# EAGLE design MCP23S17 Breakout (EAGLE 7.6.0)
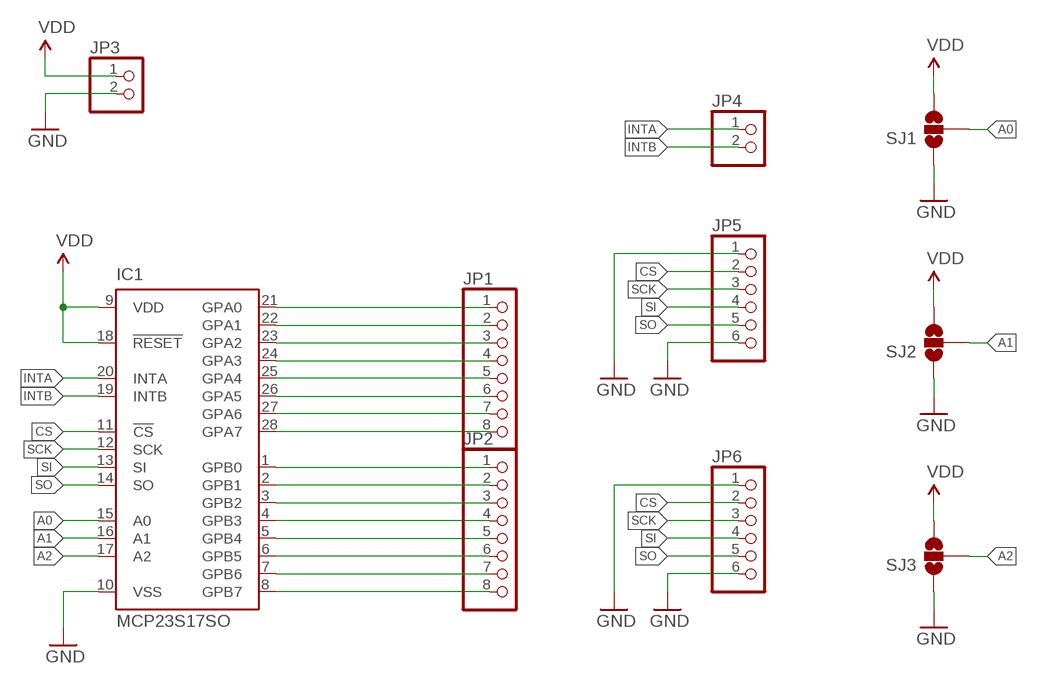
[diagram p0: schematic, sheet 1]

## Parts
IC1  MCP23S17SO  [SO28W]
JP1  PINHD-1X8  [1X08]
JP2  PINHD-1X8  [1X08]
JP3  PINHD-1X2  [1X02]
JP4  PINHD-1X2  [1X02]
JP5  PINHD-1X6  [1X06]
JP6  PINHD-1X6  [1X06]
SJ1  SOLDERJUMPER_2WAYT  [SJ_2]
SJ2  SOLDERJUMPER_2WAYT  [SJ_2]
SJ3  SOLDERJUMPER_2WAYT  [SJ_2]

## Nets
3.3V: IC1.9(VDD) IC1.18(!RESET) JP3.1 SJ1.3 SJ2.3 SJ3.3 ; supply symbol labelled VDD
A0: IC1.15(A0) SJ1.2
A1: IC1.16(A1) SJ2.2
A2: IC1.17(A2) SJ3.2
CS: IC1.11(!CS) JP5.2 JP6.2
GND: IC1.10(VSS) JP3.2 JP5.1 JP5.6 JP6.1 JP6.6 SJ1.1 SJ2.1 SJ3.1
INTA: IC1.20(INTA) JP4.1
INTB: IC1.19(INTB) JP4.2
N$1: IC1.21(GPA0) JP1.1
N$2: IC1.22(GPA1) JP1.2
N$3: IC1.23(GPA2) JP1.3
N$4: IC1.24(GPA3) JP1.4
N$5: IC1.25(GPA4) JP1.5
N$6: IC1.26(GPA5) JP1.6
N$7: IC1.27(GPA6) JP1.7
N$8: IC1.28(GPA7) JP1.8
N$9: IC1.1(GPB0) JP2.1
N$10: IC1.2(GPB1) JP2.2
N$11: IC1.3(GPB2) JP2.3
N$12: IC1.4(GPB3) JP2.4
N$13: IC1.5(GPB4) JP2.5
N$14: IC1.6(GPB5) JP2.6
N$15: IC1.7(GPB6) JP2.7
N$16: IC1.8(GPB7) JP2.8
SCK: IC1.12(SCK) JP5.3 JP6.3
SI: IC1.13(SI) JP5.4 JP6.4
SO: IC1.14(SO) JP5.5 JP6.5

## Library data of the parts
IC1 = microchip:MCP23S17: http://ww1.microchip.com/downloads/en/DeviceDoc/21952a.pdf Source: http://ww1.microchip.com/downloads/en/DeviceDoc/21952a.pdf; MF: MICROCHIP; MPN: MCP23S17-E/SO; OC_FARNELL: unknown; OC_NEWARK: 31K2950
JP1 JP2 = pinhead:PINHD-1X8: PIN HEADER
JP3 JP4 = pinhead:PINHD-1X2: PIN HEADER
JP5 JP6 = pinhead:PINHD-1X6: PIN HEADER
SJ1-SJ3 = SparkFun-Retired:SOLDERJUMPER_2WAY: Solder Jumper 2 way solder jumper

## Board
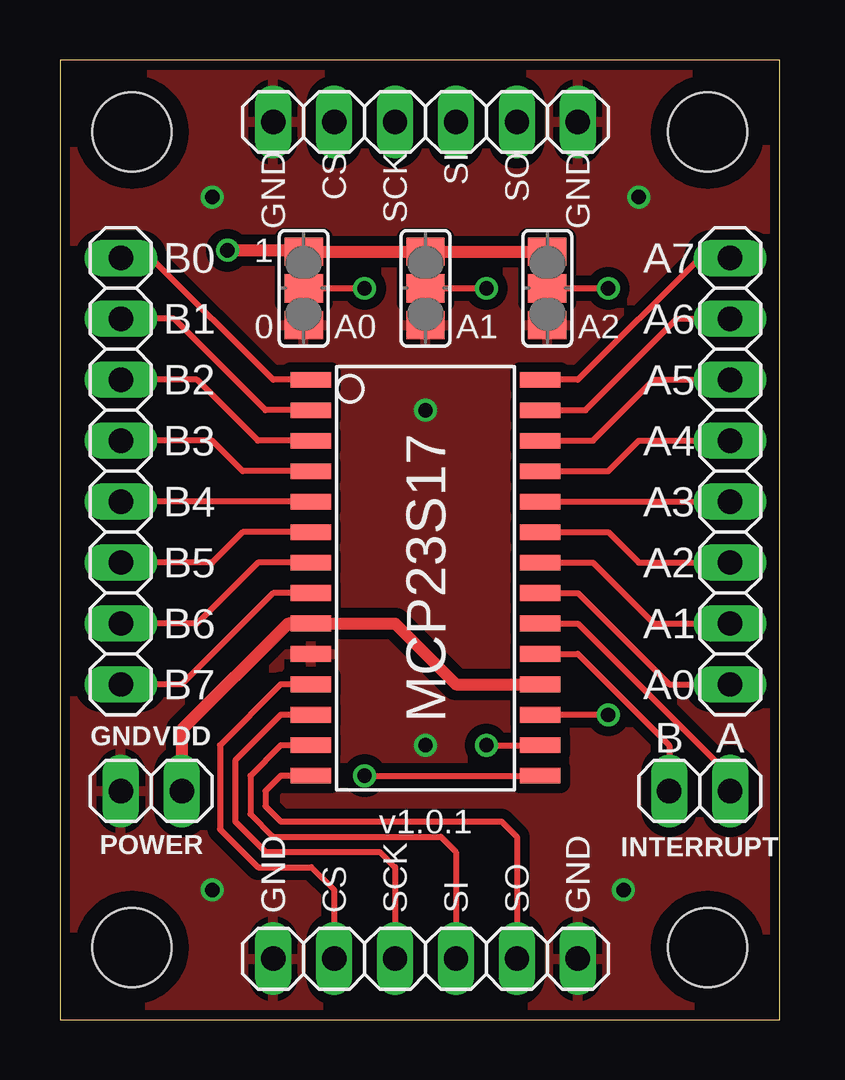
[diagram p1: board, top side]
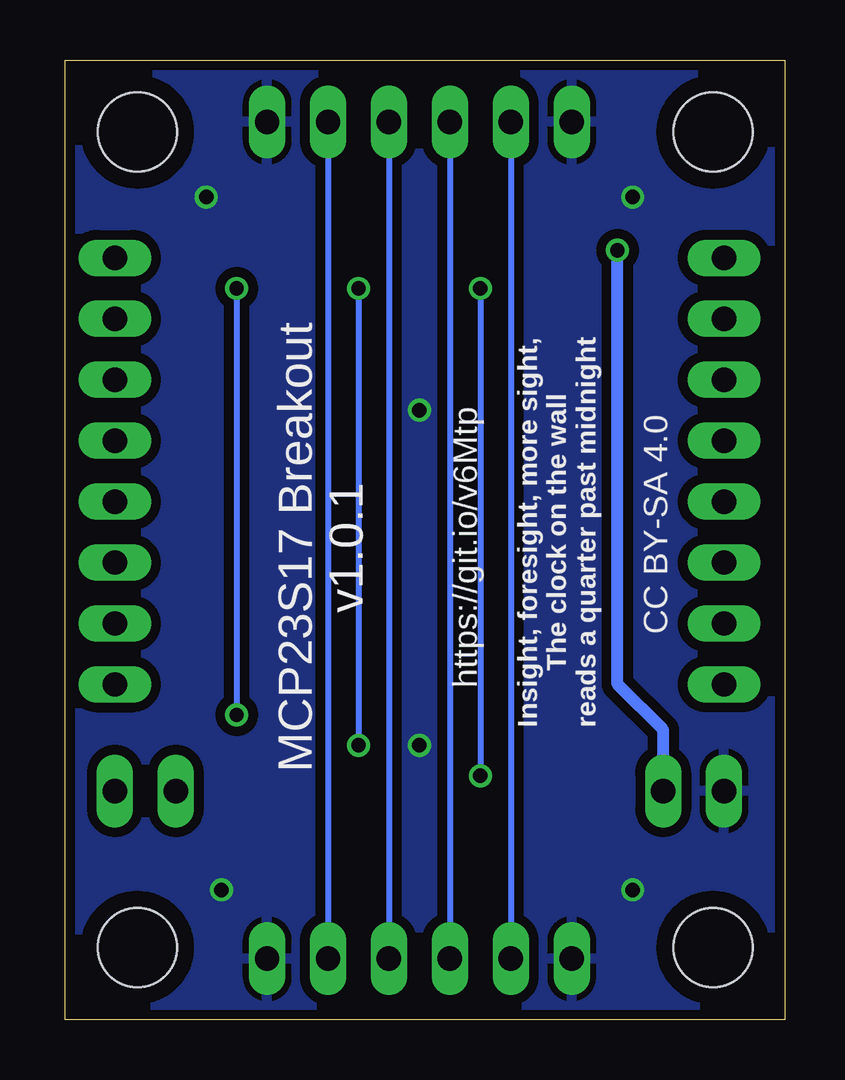
[diagram p2: board, bottom side, seen from below]

Size 30 x 40 mm. Coordinates in mm from the lower left corner, seen from the top.
Outline: 0,0 30,0 30,40 0,40 0,0
Copper layers (1*16): Top 0.0356mm / dielectric 1.5011mm / Bottom 0.0356mm
Design rules "LaenPCBOrder": minimum track width 6mil, minimum drill 13mil, track to track 6mil, track to pad 6mil, pad to pad 6mil, via to via 6mil, smd to smd 6mil, copper to edge 15mil, drill to drill 6mil, minimum pad ring 7mil, minimum via ring 7mil, stop-mask expansion 3mil, vias tented up to drill 0mil, thermal gap 10mil

### Footprints (pad centres in the part's own frame; a part is rotated, then mirrored left to right if it is on the bottom)
SO28W = smd 0.65 x 1.7: 1 -7.62,-4.78; 2 -6.35,-4.78; 3 -5.08,-4.78; 4 -3.81,-4.78; 5 -2.54,-4.78; 6 -1.27,-4.78; 7 0,-4.78; 8 1.27,-4.78; 9 2.54,-4.78; 10 3.81,-4.78; 11 5.08,-4.78; 12 6.35,-4.78; 13 7.62,-4.78; 14 8.89,-4.78; 15 8.89,4.78; 16 7.62,4.78; 17 6.35,4.78; 18 5.08,4.78; 19 3.81,4.78; 20 2.54,4.78; 21 1.27,4.78; 22 0,4.78; 23 -1.27,4.78; 24 -2.54,4.78; 25 -3.81,4.78; 26 -5.08,4.78; 27 -6.35,4.78; 28 -7.62,4.78
1X08 = drill 1.016 long: 1 -8.89,0; 2 -6.35,0; 3 -3.81,0; 4 -1.27,0; 5 1.27,0; 6 3.81,0; 7 6.35,0; 8 8.89,0
1X02 = drill 1.016 long: 1 -1.27,0; 2 1.27,0
1X06 = drill 1.016 long: 1 -6.35,0; 2 -3.81,0; 3 -1.27,0; 4 1.27,0; 5 3.81,0; 6 6.35,0
SJ_2 = smd 1.168 x 1.6: 1 -1.524,0; 2 0,0; 3 1.524,0
STAND-OFF = hole 3.302: 0,0

### Placement (x,y rotation side)
IC1  15.24,19.05 270 top
JP1  27.94,22.86 90 top
JP2  2.54,22.86 270 top
JP3  3.81,9.53 180 top
JP4  26.67,9.53 180 top
JP5  15.24,2.54 0 top
JP6  15.24,37.42 0 top
SJ1  10.16,30.48 90 top
SJ2  15.24,30.48 90 top
SJ3  20.32,30.48 90 top
U$1  [STAND-OFF]  3,37 90 top
U$2  [STAND-OFF]  27,37 0 top
U$3  [STAND-OFF]  3,3 0 top
U$4  [STAND-OFF]  27,3 0 top

### Tracks (layer width: path | path; a pad name or v marks a point on that pad's centre or on a via)
3.3V  (via drill 0.6)
  Top 0.508: IC1.18 16.51,13.97 13.97,16.51 IC1.9 9.53,16.51 5.08,12.06 JP3.1 | v6.99,32.07 10.1,32.07 SJ1.3 SJ2.3 SJ3.3
  Bottom 0.508: JP3.1 5.08,12.06 6.99,13.97 v6.99,32.07
A0  (via drill 0.6)
  Top 0.254: v12.7,10.16 IC1.15 | SJ1.2 v12.7,30.48
  Bottom 0.254: v12.7,30.48 v12.7,10.16
A1  (via drill 0.6)
  Top 0.254: v17.78,11.43 IC1.16 | SJ2.2 v17.78,30.48
  Bottom 0.254: v17.78,30.48 v17.78,11.43
A2  (via drill 0.6)
  Top 0.254: v22.86,12.7 IC1.17 | SJ3.2 v22.86,30.48
  Bottom 0.254: v22.86,30.48 v22.86,12.7
CS
  Top 0.254: IC1.11 9.21,13.97 6.67,11.43 6.67,7.94 8.26,6.35 10.48,6.35 11.43,5.4 JP5.2
  Bottom 0.254: JP6.2 JP5.2
GND  (via drill 0.6)
  other vias: 24.13,34.29 23.5,5.4 15.24,11.43 15.24,25.4 6.35,34.29 23.5,5.4 6.35,5.4
  pour Top (isolate 0.406): 0,40.01 30.16,40.01 30.16,0 0,0
  pour Bottom (isolate 0.406): 0,40.01 30.16,40.01 30.16,0 0,0
INTA
  Top 0.254: IC1.20 21.59,16.51 27.94,10.16 JP4.1
INTB
  Top 0.254: IC1.19 21.59,15.24 25.4,11.43 JP4.2
N$1
  Top 0.254: IC1.21 21.59,17.78 25.4,13.97 JP1.1
N$2
  Top 0.254: IC1.22 22.23,19.05 24.77,16.51 JP1.2
N$3
  Top 0.254: IC1.23 22.86,20.32 24.13,19.05 JP1.3
N$4
  Top 0.254: IC1.24 JP1.4
N$5
  Top 0.254: IC1.25 22.86,22.86 24.13,24.13 JP1.5
N$6
  Top 0.254: IC1.26 22.23,24.13 24.77,26.67 JP1.6
N$7
  Top 0.254: IC1.27 21.91,25.4 25.72,29.21 JP1.7
N$8
  Top 0.254: JP1.8 26.67,31.75 21.59,26.67 IC1.28
N$9
  Top 0.254: IC1.1 8.89,26.67 3.81,31.75 JP2.1
N$10
  Top 0.254: IC1.2 8.57,25.4 4.76,29.21 JP2.2
N$11
  Top 0.254: IC1.3 8.26,24.13 5.71,26.67 JP2.3
N$12
  Top 0.254: IC1.4 7.62,22.86 6.35,24.13 JP2.4
N$13
  Top 0.254: IC1.5 JP2.5
N$14
  Top 0.254: IC1.6 7.62,20.32 6.35,19.05 JP2.6
N$15
  Top 0.254: IC1.7 8.26,19.05 5.71,16.51 JP2.7
N$16
  Top 0.254: IC1.8 8.89,17.78 5.08,13.97 JP2.8
SCK
  Top 0.254: IC1.12 9.21,12.7 7.3,10.79 7.3,8.26 8.57,6.99 13.34,6.99 13.97,6.35 JP5.3
  Bottom 0.254: JP6.3 JP5.3
SI
  Top 0.254: IC1.13 9.21,11.43 7.94,10.16 7.94,8.57 8.89,7.62 15.88,7.62 16.51,6.99 JP5.4
  Bottom 0.254: JP6.4 JP5.4
SO
  Top 0.254: IC1.14 9.21,10.16 8.57,9.53 8.57,8.89 9.21,8.26 18.41,8.26 19.05,7.62 JP5.5
  Bottom 0.254: JP6.5 JP5.5

### Text on the board
tPlace: GND | CS | SCK | SI | SO | GND | B0 | 1 | A7 | B1 | 0 | A0 | A1 | A2 | A6 | B2 | A5 | B3 | A4 | B4 | A3 | B5 | A2 | MCP23S17 | B6 | A1 | B7 | A0 | GND | VDD | B | A | v1.0.1 | INTERRUPT | POWER | GND | GND | CS | SCK | SI | SO | GND | GND
bPlace: CC BY-SA 4.0 | Insight, foresight, more sight, / The clock on the wall / reads a quarter past midnight | https://git.io/v6Mtp | MCP23S17 Breakout / v1.0.1